# EAGLE schematic PCB_Schematic (EAGLE 9.7.0)
AUTHOR: Jack Maxwell; REVISION: 2

## Sheet 1 of 2
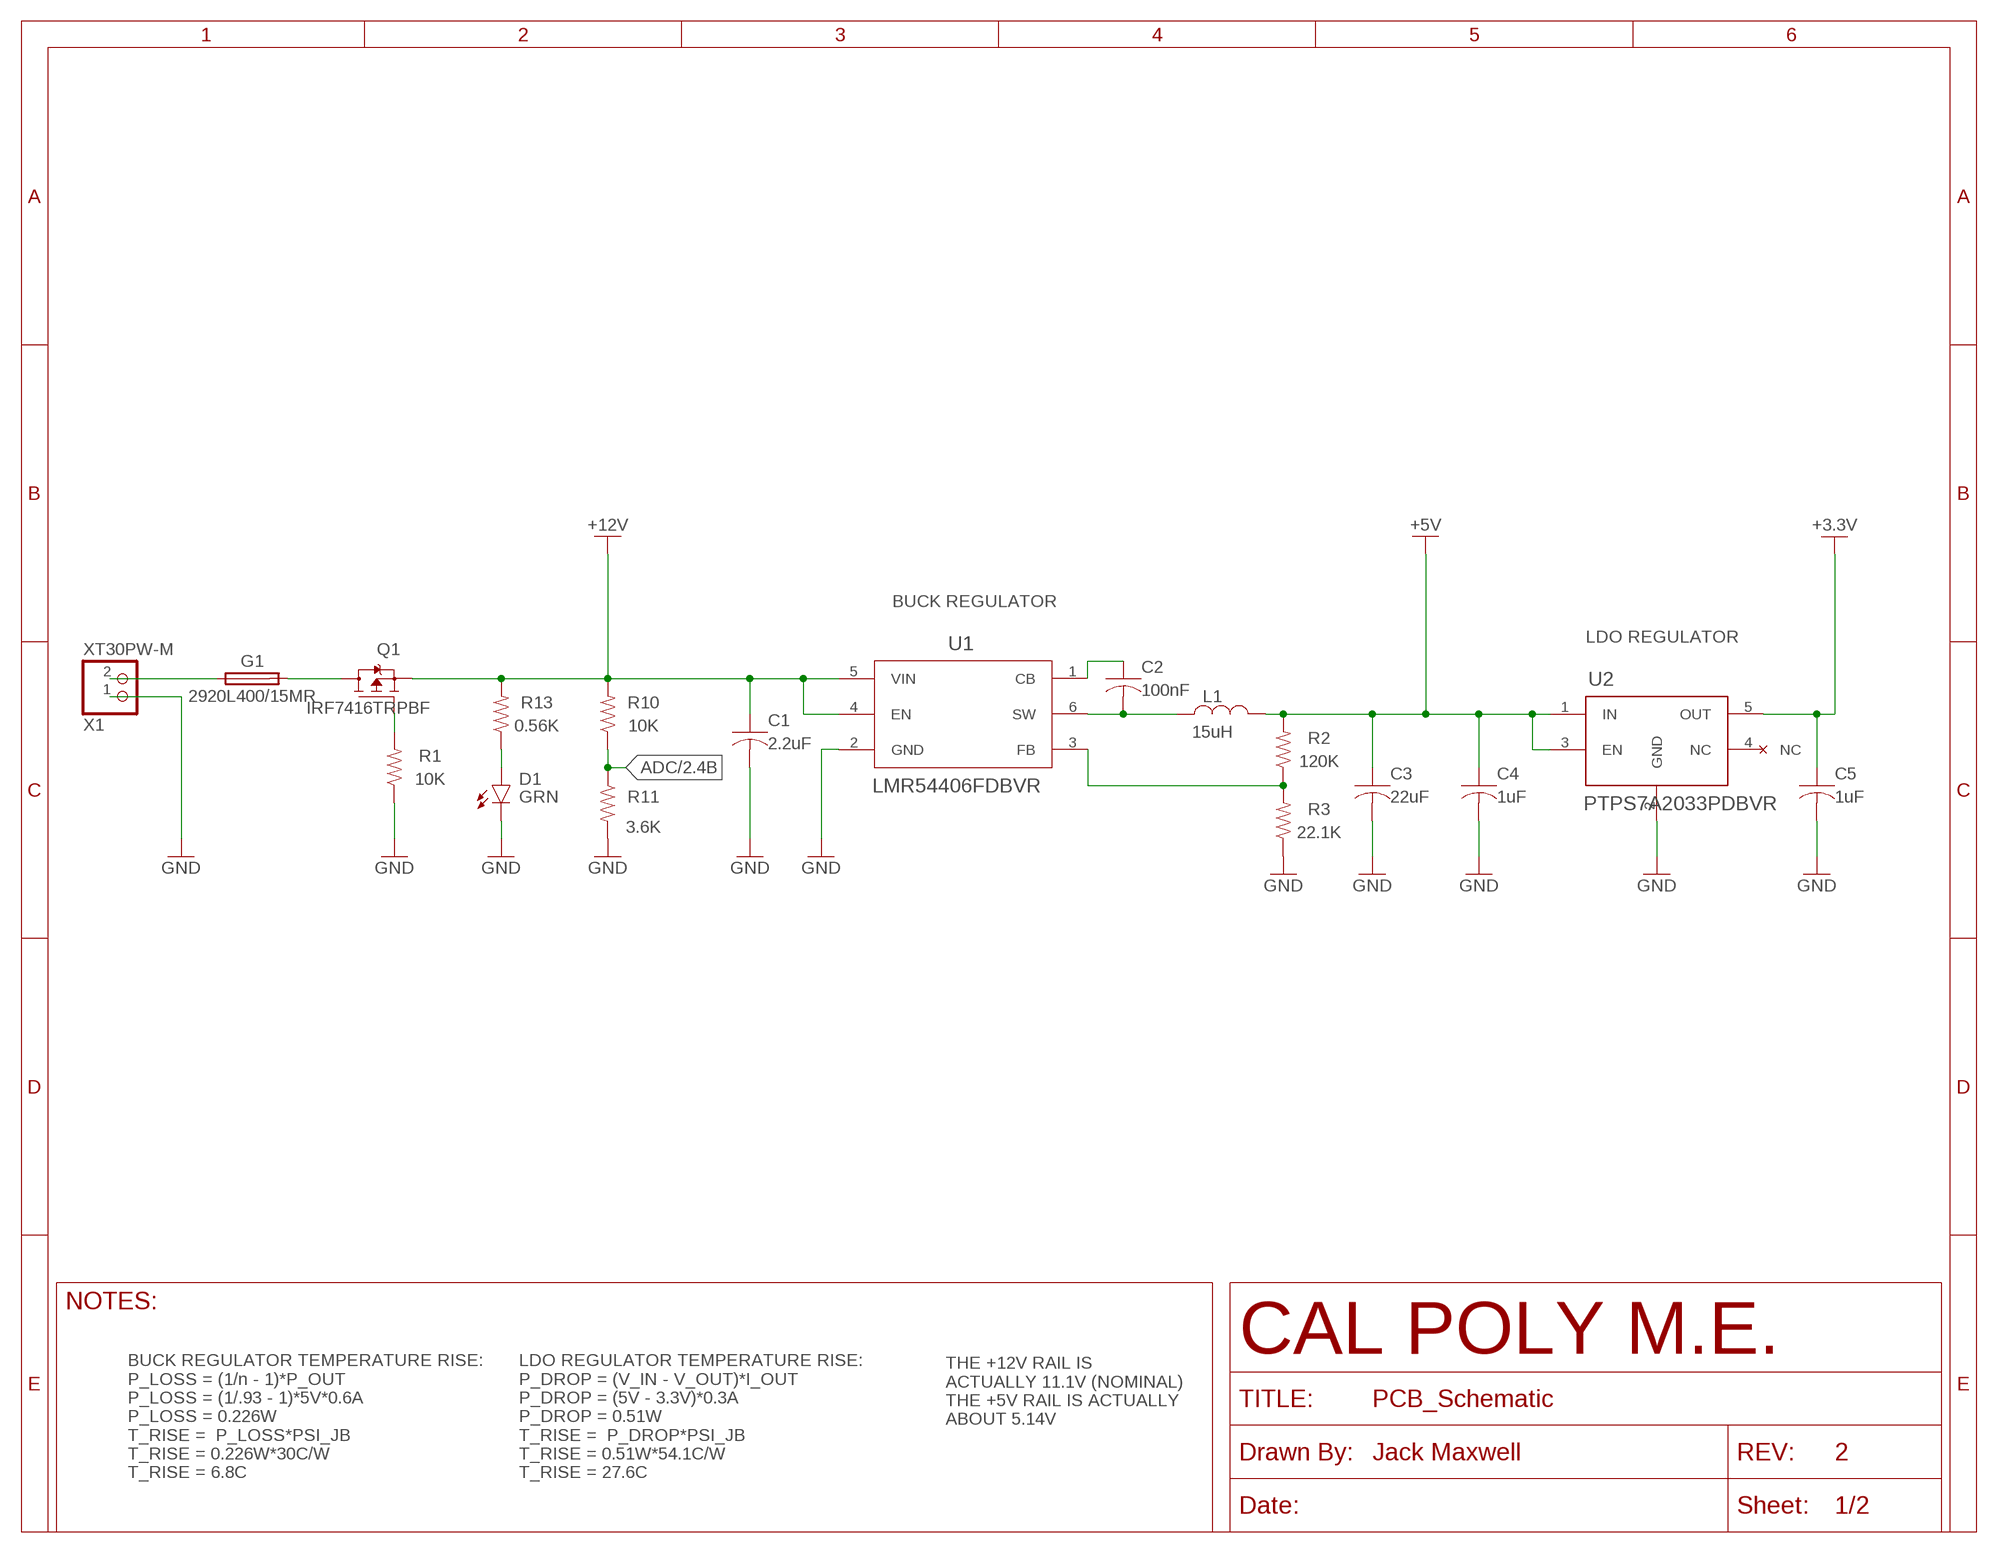
[diagram p0: schematic, sheet 1]

### Parts
C1  2.2uF  C-US_CHIP-0805(2012-METRIC)  [CAPC2012X110]
C2  100nF  C-US_CHIP-0603(1608-METRIC)  [CAPC1608X85]
C3  22uF  C-US_CHIP-1206(3216-METRIC)  [CAPC3216X135]
C4  1uF  C-US_CHIP-0805(2012-METRIC)  [CAPC2012X110]
C5  1uF  C-US_CHIP-0805(2012-METRIC)  [CAPC2012X110]
D1  GRN  CHIP-FLAT-G_0805  [LEDC2012X110N_FLAT-G]
G1  2920L400/15MR  [FUSC7351X160]
L1  15uH  XGL4040-153MECIND_XGL4040_COC  [IND_XGL4040_COC]
Q1  IRF7416TRPBF  BSO201SPH  [SO-8]
R1  10K  R-US_CHIP-0805(2012-METRIC)  [RESC2012X65]
R2  120K  R-US_CHIP-0805(2012-METRIC)  [RESC2012X65]
R3  22.1K  R-US_CHIP-0805(2012-METRIC)  [RESC2012X65]
R10  10K  R-US_CHIP-0805(2012-METRIC)  [RESC2012X65]
R11  3.6K  R-US_CHIP-0603(1608-METRIC)  [RESC1608X60]
R13  0.56K  R-US_CHIP-1210(3225-METRIC)  [RESC3224X71]
U1  LMR54406FDBVR  LMR54406FDBVRLMR54406DBVR_TEX  [LMR54406DBVR_TEX]
U2  PTPS7A2033PDBVR  PTPS7A2033PDBVRDBV0005A-MFG  [DBV0005A-MFG]
U$1  NC  (no package)
X1  XT30PW-M  [XT30PW-M]

### Nets
+3.3V: C5.1 U2.5(OUT) ; also sheet 2
+5V: C3.1 C4.1 L1.2 R2.2 U2.1(IN) U2.3(EN) ; also sheet 2
+12V: C1.1 Q1.1(S) Q1.2(S) Q1.3(S) R10.2 R13.2 U1.4(EN) U1.5(VIN) ; also sheet 2
ADC: R10.1 R11.1 ; also sheet 2
GND: C1.2 C3.2 C4.2 C5.2 D1.C R1.1 R3.1 R11.2 U1.2(GND) U2.2(GND) X1.1 ; also sheet 2
N$1: C2.1 U1.1(CB)
N$2: C2.2 L1.1 U1.6(SW)
N$3: Q1.4(G) R1.2
N$4: R2.1 R3.2 U1.3(FB)
N$5: U2.4(NC) U$1.NC
N$6: G1.1 X1.2
N$7: G1.2 Q1.5(D) Q1.6(D) Q1.7(D) Q1.8(D)
N$18: D1.A R13.1

### Notes on the sheet
- BUCK REGULATOR
- LDO REGULATOR
- THE +12V RAIL IS
  ACTUALLY 11.1V (NOMINAL) 
  THE +5V RAIL IS ACTUALLY 
  ABOUT 5.14V
- BUCK REGULATOR TEMPERATURE RISE:
  P_LOSS = (1/n - 1)*P_OUT
  P_LOSS = (1/.93 - 1)*5V*0.6A
  P_LOSS = 0.226W
  T_RISE =  P_LOSS*PSI_JB
  T_RISE = 0.226W*30C/W
  T_RISE = 6.8C
- LDO REGULATOR TEMPERATURE RISE:
  P_DROP = (V_IN - V_OUT)*I_OUT
  P_DROP = (5V - 3.3V)*0.3A
  P_DROP = 0.51W
  T_RISE =  P_DROP*PSI_JB
  T_RISE = 0.51W*54.1C/W
  T_RISE = 27.6C

## Sheet 2 of 2
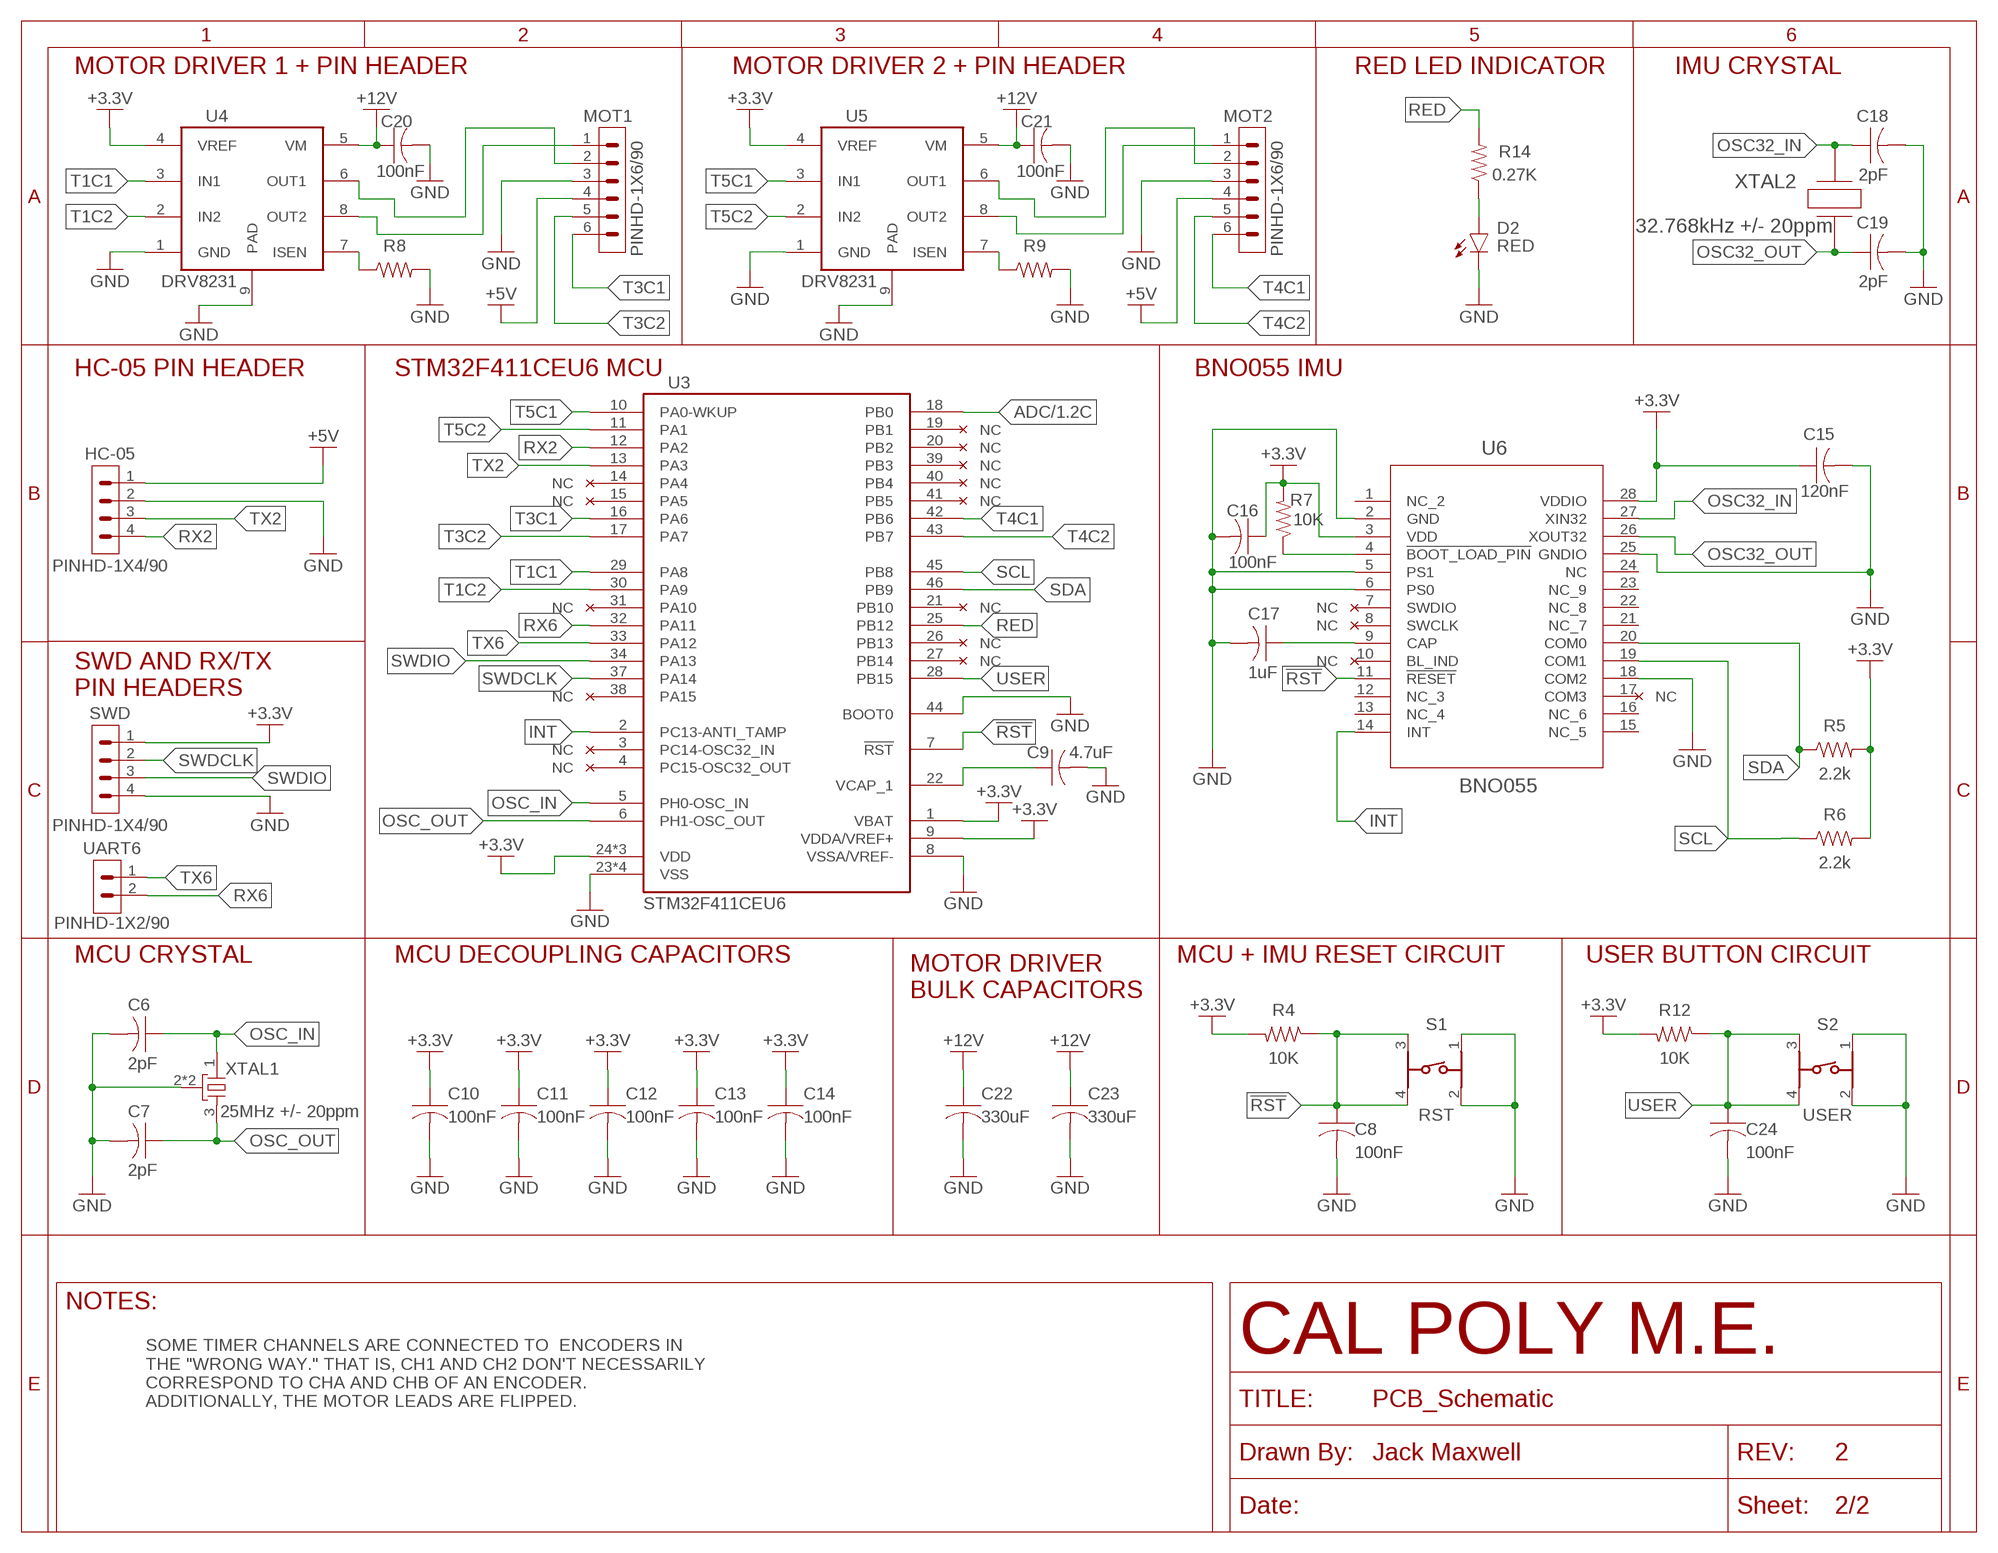
[diagram p1: schematic, sheet 2]

### Parts
C6  2pF  C-US_CHIP-0402(1005-METRIC)  [CAPC1005X60]
C7  2pF  C-US_CHIP-0402(1005-METRIC)  [CAPC1005X60]
C8  100nF  C-US_CHIP-0402(1005-METRIC)  [CAPC1005X60]
C9  4.7uF  C-US_CHIP-1206(3216-METRIC)  [CAPC3216X135]
C10  100nF  C-US_CHIP-0402(1005-METRIC)  [CAPC1005X60]
C11  100nF  C-US_CHIP-0402(1005-METRIC)  [CAPC1005X60]
C12  100nF  C-US_CHIP-0402(1005-METRIC)  [CAPC1005X60]
C13  100nF  C-US_CHIP-0402(1005-METRIC)  [CAPC1005X60]
C14  100nF  C-US_CHIP-0402(1005-METRIC)  [CAPC1005X60]
C15  120nF  C-US_CHIP-0603(1608-METRIC)  [CAPC1608X85]
C16  100nF  C-US_CHIP-0402(1005-METRIC)  [CAPC1005X60]
C17  1uF  C-US_CHIP-0603(1608-METRIC)  [CAPC1608X85]
C18  2pF  C-US_CHIP-0402(1005-METRIC)  [CAPC1005X60]
C19  2pF  C-US_CHIP-0402(1005-METRIC)  [CAPC1005X60]
C20  100nF  C-US_CHIP-0603(1608-METRIC)  [CAPC1608X85]
C21  100nF  C-US_CHIP-0603(1608-METRIC)  [CAPC1608X85]
C22  330uF  GVM1E331M0607  [CAPAE660X800N]
C23  330uF  GVM1E331M0607  [CAPAE660X800N]
C24  100nF  C-US_CHIP-0402(1005-METRIC)  [CAPC1005X60]
D2  RED  CHIP-FLAT-R_0805  [LEDC2012X110N_FLAT-R]
HC-05  PINHD-1X4/90  [1X04/90]
MOT1  PINHD-1X6/90  [1X06/90]
MOT2  PINHD-1X6/90  [1X06/90]
R4  10K  R-US_CHIP-0805(2012-METRIC)  [RESC2012X65]
R5  2.2k  R-US_CHIP-0603(1608-METRIC)  [RESC1608X60]
R6  2.2k  R-US_CHIP-0603(1608-METRIC)  [RESC1608X60]
R7  10K  R-US_CHIP-0805(2012-METRIC)  [RESC2012X65]
R8  R-US_CHIP-1206(3216-METRIC)  [RESC3216X70]
R9  R-US_CHIP-1206(3216-METRIC)  [RESC3216X70]
R12  10K  R-US_CHIP-0805(2012-METRIC)  [RESC2012X65]
R14  0.27K  R-US_CHIP-0805(2012-METRIC)  [RESC2012X65]
S1  RST  430481035816  [430481035816]
S2  USER  430481035816  [430481035816]
SWD  PINHD-1X4/90  [1X04/90]
U3  STM32F411CEU6  [QFN50P700X700X100-48N]
U4  DRV8231  [DRV8231DDAR]
U5  DRV8231  [DRV8231DDAR]
U6  BNO055  BNO055QFN_BNO055_BOS  [QFN_BNO055_BOS]
U$2  NC  (no package)
U$3  NC  (no package)
U$4  NC  (no package)
U$5  NC  (no package)
U$6  NC  (no package)
U$7  NC  (no package)
U$8  NC  (no package)
U$9  NC  (no package)
U$10  NC  (no package)
U$11  NC  (no package)
U$12  NC  (no package)
U$13  NC  (no package)
U$15  NC  (no package)
U$18  NC  (no package)
U$21  NC  (no package)
U$22  NC  (no package)
U$32  NC  (no package)
U$34  NC  (no package)
UART6  PINHD-1X2/90  [1X02/90]
XTAL1  25MHz +/- 20ppm  CS11321-25M  [OSCCC200X160X50N]
XTAL2  32.768kHz +/- 20ppm  STD-MUA-14CHIP_NX3215S_NDK  [CHIP_NX3215S_NDK]

### Nets
!RST!: C8.1 R4.1 S1.3 S1.4 U3.7(!RST) U6.11(!RESET)
+3.3V: C10.1 C11.1 C12.1 C13.1 C14.1 C15.1 C16.1 R4.2 R5.2 R6.2 R7.2 R12.2 SWD.1 U3.1(VBAT) U3.9(VDDA/VREF+) U3.24(VDD) U3.36(VDD) U3.48(VDD) U4.4(VREF) U5.4(VREF) U6.3(VDD) U6.28(VDDIO) ; also sheet 1
+5V: HC-05.1 MOT1.4 MOT2.4 ; also sheet 1
+12V: C20.1 C21.1 C22.1 C23.1 U4.5(VM) U5.5(VM) ; also sheet 1
ADC: U3.18(PB0) ; also sheet 1
GND: C6.2 C7.2 C8.2 C9.2 C10.2 C11.2 C12.2 C13.2 C14.2 C15.2 C16.2 C17.2 C18.2 C19.2 C20.2 C21.2 C22.2 C23.2 C24.2 D2.C HC-05.2 MOT1.3 MOT2.3 R8.2 R9.2 S1.1 S1.2 S2.1 S2.2 SWD.4 U3.8(VSSA/VREF-) U3.23(VSS) U3.35(VSS) U3.44(BOOT0) U3.47(VSS) U3.49(VSS) U4.1(GND) U4.9(PAD) U5.1(GND) U5.9(PAD) U6.2(GND) U6.5(PS1) U6.6(PS0) U6.18(COM2) U6.25(GNDIO) XTAL1.2(GND) XTAL1.4(GND) ; also sheet 1
INT: U3.2(PC13-ANTI_TAMP) U6.14(INT)
N$8: MOT1.2 U4.6(OUT1)
N$9: MOT1.1 U4.8(OUT2)
N$10: C17.1 U6.9(CAP)
N$11: U3.38(PA15) U$5.NC
N$12: U3.20(PB2) U$7.NC
N$13: U3.39(PB3) U$8.NC
N$14: U3.40(PB4) U$9.NC
N$15: U3.41(PB5) U$10.NC
N$16: R7.1 U6.4(!BOOT_LOAD_PIN)
N$17: R8.1 U4.7(ISEN)
N$19: U3.19(PB1) U$11.NC
N$20: U3.21(PB10) U$15.NC
N$21: U3.26(PB13) U$13.NC
N$23: U3.27(PB14) U$18.NC
N$25: MOT2.2 U5.6(OUT1)
N$26: U3.4(PC15-OSC32_OUT) U$21.NC
N$27: U3.3(PC14-OSC32_IN) U$22.NC
N$29: MOT2.1 U5.8(OUT2)
N$30: D2.A R14.1
N$31: U6.17(COM3) U$6.NC
N$32: U6.7(SWDIO) U$2.NC
N$33: U6.8(SWCLK) U$3.NC
N$34: U6.10(BL_IND) U$4.NC
N$35: R9.1 U5.7(ISEN)
N$36: U3.31(PA10) U$12.NC
N$37: U3.15(PA5) U$32.NC
N$39: U3.14(PA4) U$34.NC
OSC32_IN: C18.1 U6.27(XIN32) XTAL2.2
OSC32_OUT: C19.1 U6.26(XOUT32) XTAL2.1
OSC_IN: C6.1 U3.5(PH0-OSC_IN) XTAL1.1
OSC_OUT: C7.1 U3.6(PH1-OSC_OUT) XTAL1.3
RED: R14.2 U3.25(PB12)
RX2: HC-05.4 U3.12(PA2)
RX6: U3.32(PA11) UART6.2
SCL: R6.1 U3.45(PB8) U6.19(COM1)
SDA: R5.1 U3.46(PB9) U6.20(COM0)
SWDCLK: SWD.2 U3.37(PA14)
SWDIO: SWD.3 U3.34(PA13)
T1C1: U3.29(PA8) U4.3(IN1)
T1C2: U3.30(PA9) U4.2(IN2)
T3C1: MOT1.6 U3.16(PA6)
T3C2: MOT1.5 U3.17(PA7)
T4C1: MOT2.6 U3.42(PB6)
T4C2: MOT2.5 U3.43(PB7)
T5C1: U3.10(PA0-WKUP) U5.3(IN1)
T5C2: U3.11(PA1) U5.2(IN2)
TX2: HC-05.3 U3.13(PA3)
TX6: U3.33(PA12) UART6.1
USER: C24.1 R12.1 S2.3 S2.4 U3.28(PB15)
VCAP_1: C9.1 U3.22(VCAP_1)
Unconnected: U6.1(NC_2) U6.12(NC_3) U6.13(NC_4) U6.15(NC_5) U6.16(NC_6) U6.21(NC_7) U6.22(NC_8) U6.23(NC_9) U6.24(NC)

### Notes on the sheet
- MOTOR DRIVER 1 + PIN HEADER | MOTOR DRIVER 2 + PIN HEADER | RED LED INDICATOR | IMU CRYSTAL
- HC-05 PIN HEADER | STM32F411CEU6 MCU | BNO055 IMU
- SWD AND RX/TX
  PIN HEADERS
- MCU CRYSTAL | MCU DECOUPLING CAPACITORS | MCU + IMU RESET CIRCUIT | USER BUTTON CIRCUIT
- MOTOR DRIVER
  BULK CAPACITORS
- SOME TIMER CHANNELS ARE CONNECTED TO  ENCODERS IN 
  THE "WRONG WAY." THAT IS, CH1 AND CH2 DON'T NECESSARILY 
  CORRESPOND TO CHA AND CHB OF AN ENCODER. 
  ADDITIONALLY, THE MOTOR LEADS ARE FLIPPED.

## Library data of the parts
C1 C4 C5 = Capacitor:C-US: Capacitor - ANSI; CATEGORY: Capacitor; PACKAGE_SIZE: 0805; PACKAGE_TYPE: SMD; SUBCATEGORY: Ceramic Capacitors; TYPE: MLCC
C2 C15 C17 C20 C21 = Capacitor:C-US: Capacitor - ANSI; CATEGORY: Capacitor; PACKAGE_SIZE: 0603; PACKAGE_TYPE: SMD; SUBCATEGORY: Ceramic Capacitors; TYPE: MLCC
C3 C9 = Capacitor:C-US: Capacitor - ANSI; CATEGORY: Capacitor; PACKAGE_SIZE: 1206; PACKAGE_TYPE: SMD; SUBCATEGORY: Ceramic Capacitors; TYPE: MLCC
C6-C8 C10-C14 C16 C18 C19 C24 = Capacitor:C-US: Capacitor - ANSI; CATEGORY: Capacitor; PACKAGE_SIZE: 0402; PACKAGE_TYPE: SMD; SUBCATEGORY: Ceramic Capacitors; TYPE: MLCC
C22 C23 = GVM1E331M0607:GVM1E331M0607
D1 = LED:CHIP-FLAT-G: Green LED - Generic; CATEGORY: LED; COLOR: Green; DESCRIPTION: Green LED Indication 0805 (2012 Metric); PACKAGE_SIZE: 0805; PACKAGE_TYPE: SMD; SUBCATEGORY: Chip LED; TYPE: Square with Flat Top
D2 = LED:CHIP-FLAT-R: Red LED - Generic; CATEGORY: LED; COLOR: Red; DESCRIPTION: Red LED Indication 0805 (2012 Metric); PACKAGE_SIZE: 0805; PACKAGE_TYPE: SMD; SUBCATEGORY: Chip LED; TYPE: Square with Flat Top
G1 = Fuse (Custom):2920L400/15MR
HC-05 SWD = Connector:PINHD-1X4: Pin Header; CATEGORY: Connectors; DESCRIPTION: Header-Right Angle-4 Position; PACKAGE_TYPE: Through Hole; PITCH: 0.100" (2.54mm); SUBCATEGORY: Headers; TYPE: Male Pins
L1 = XGL4040-153MEC:XGL4040-153MEC; COPYRIGHT: Copyright (C) 2025 Ultra Librarian. All rights reserved.; MANUFACTURER_PART_NUMBER: XGL4040-153MEC; MFR_NAME: Coilcraft
MOT1 MOT2 = Connector:PINHD-1X6: Pin Header; CATEGORY: Connectors; DESCRIPTION: Header-Right Angle-6 Position; PACKAGE_TYPE: Through Hole; PITCH: 0.100" (2.54mm); SUBCATEGORY: Headers; TYPE: Male Pins
Q1 = Transistor:BSO201SP*: P-Channel 20 V 12A (Ta) 1.6W (Ta) Surface Mount PG-DSO-8; CATEGORY: Transistor; DATASHEET: https://www.infineon.com/dgdl/BSO201SP_H_1.32.pdf; DESCRIPTION: P-Channel 20 V 12A (Ta) 1.6W (Ta) Surface Mount PG-DSO-8; DRAIN_CURRENT: 12 A; IC_MAX: NA; MANUFACTURER: Infineon Technologies; MPN: BSO201SPHXUMA1; OPERATING_TEMPERATURE: -55°C ~ 150°C; PACKAGE_SIZE: 8-SOIC; PACKAGE_TYPE: SMD; PART_STATUS: ACTIVE; ROHS: COMPLIANT; SERIES: OptiMOS™; SUBCATEGORY: MOSFET; THERMALLOSS: 1.6 W; TYPE: P-Channel; VCEO_MAX: NA
R1-R4 R7 R10 R12 R14 = Resistor:R-US: Resistor Fixed - ANSI; CATEGORY: Resistors; DESCRIPTION: Chip Resistor 2.00 X 1.25 X 0.65 mm body 0805(2012-METRIC) Package; PACKAGE_SIZE: 0805; PACKAGE_TYPE: SMD
R5 R6 R11 = Resistor:R-US: Resistor Fixed - ANSI; CATEGORY: Resistors; DESCRIPTION: Chip Resistor 1.60 X 0.82 X 0.60 mm body 0603(1608-METRIC) Package; PACKAGE_SIZE: 0603; PACKAGE_TYPE: SMD
R8 R9 = Resistor:R-US: Resistor Fixed - ANSI; CATEGORY: Resistors; DESCRIPTION: Chip Resistor 3.20 X 1.60 X 0.70 mm body 1206(3216-METRIC) Package; PACKAGE_SIZE: 1206; PACKAGE_TYPE: SMD
R13 = Resistor:R-US: Resistor Fixed - ANSI; CATEGORY: Resistors; DESCRIPTION: Chip Resistor 3.20 X 2.49 X 0.71 mm body 1210(3225-METRIC) Package; PACKAGE_SIZE: 1210; PACKAGE_TYPE: SMD
S1 S2 = 430481035816:430481035816: WS-TASV SMT Washable Tact Switch 6x6 mm Material Properties Cover Material : Stainless Steel Properties Actuator Material:LCP Actuator Flammability :UL94 V-0 Rating Actuator Color:Black; Salmon; White Contact Material:Stainless Steel Contact Plating:Silver Terminal Plating:Silver VR:12 V (DC) RISO:100 MΩ Withstanding Voltage:250 V (AC) Washable:Yes Qty.:2000 Mechanical Properties Stroke :0.25 mm General Information Operating Temperature:-40 up to +85 °C Washable:Yes Packaging Properties Packaging:Tape and Reel <https://www.we-online.com/catalog/media/o37542v209%20Family_WS-TASV_SMD_Tact_Switch_6x6mm_4304810xx8xx.jpg> Details see: https://www.we-online.com/catalog/en/TASV_6X6_SMD_WASHABLE/ Updated by Ella Wu 2021-02-23 2021(C) Würth Elektronik; DATASHEET-URL: https://www.we-online.com/redexpert/spec/430481035816?ae; HEIGHT: 3.5mm; OPERATION-FORCE: 160g; PART-NUMBER: 430481035816; QTY: 2000; VALUE: 430481035816
U1 = LMR54406FDBVR:LMR54406FDBVR; COPYRIGHT: Copyright (C) 2025 Ultra Librarian. All rights reserved.; MANUFACTURER_PART_NUMBER: LMR54406FDBVR; MFR_NAME: Texas Instruments
U2 = TPS7A2033PDBVR:PTPS7A2033PDBVR; COPYRIGHT: Copyright (C) 2025 Ultra Librarian. All rights reserved.; MANUFACTURER_PART_NUMBER: PTPS7A2033PDBVR; MFR_NAME: Texas Instruments; REFDES: RefDes; TYPE: TYPE
U3 = STM32F411CEU6:STM32F411CEU6
U4 U5 = DRV8231:DRV8231
U6 = BNO055:BNO055; COPYRIGHT: Copyright (C) 2025 Ultra Librarian. All rights reserved.; MANUFACTURER_PART_NUMBER: BNO055; MFR_NAME: Bosch Sensortec
U$1-U$13 U$15 U$18 U$21 U$22 U$32 U$34 = noconnect:NC
UART6 = Connector:PINHD-1X2: Pin Header; CATEGORY: Connectors; DESCRIPTION: Header-Right Angle-2 Position; PACKAGE_TYPE: Through Hole; PITCH: 0.100" (2.54mm); SUBCATEGORY: Headers; TYPE: Male Pins
X1 = XT-30:XT30PW
XTAL1 = NX2016SA:CS11321-25M
XTAL2 = NX3215SA:STD-MUA-14; COPYRIGHT: Copyright (C) 2025 Ultra Librarian. All rights reserved.; MANUFACTURER_PART_NUMBER: NX3215SA-32.768K-STD-MUS-2; MFR_NAME: NDK